# Altium project STM32CORE.PrjPcb
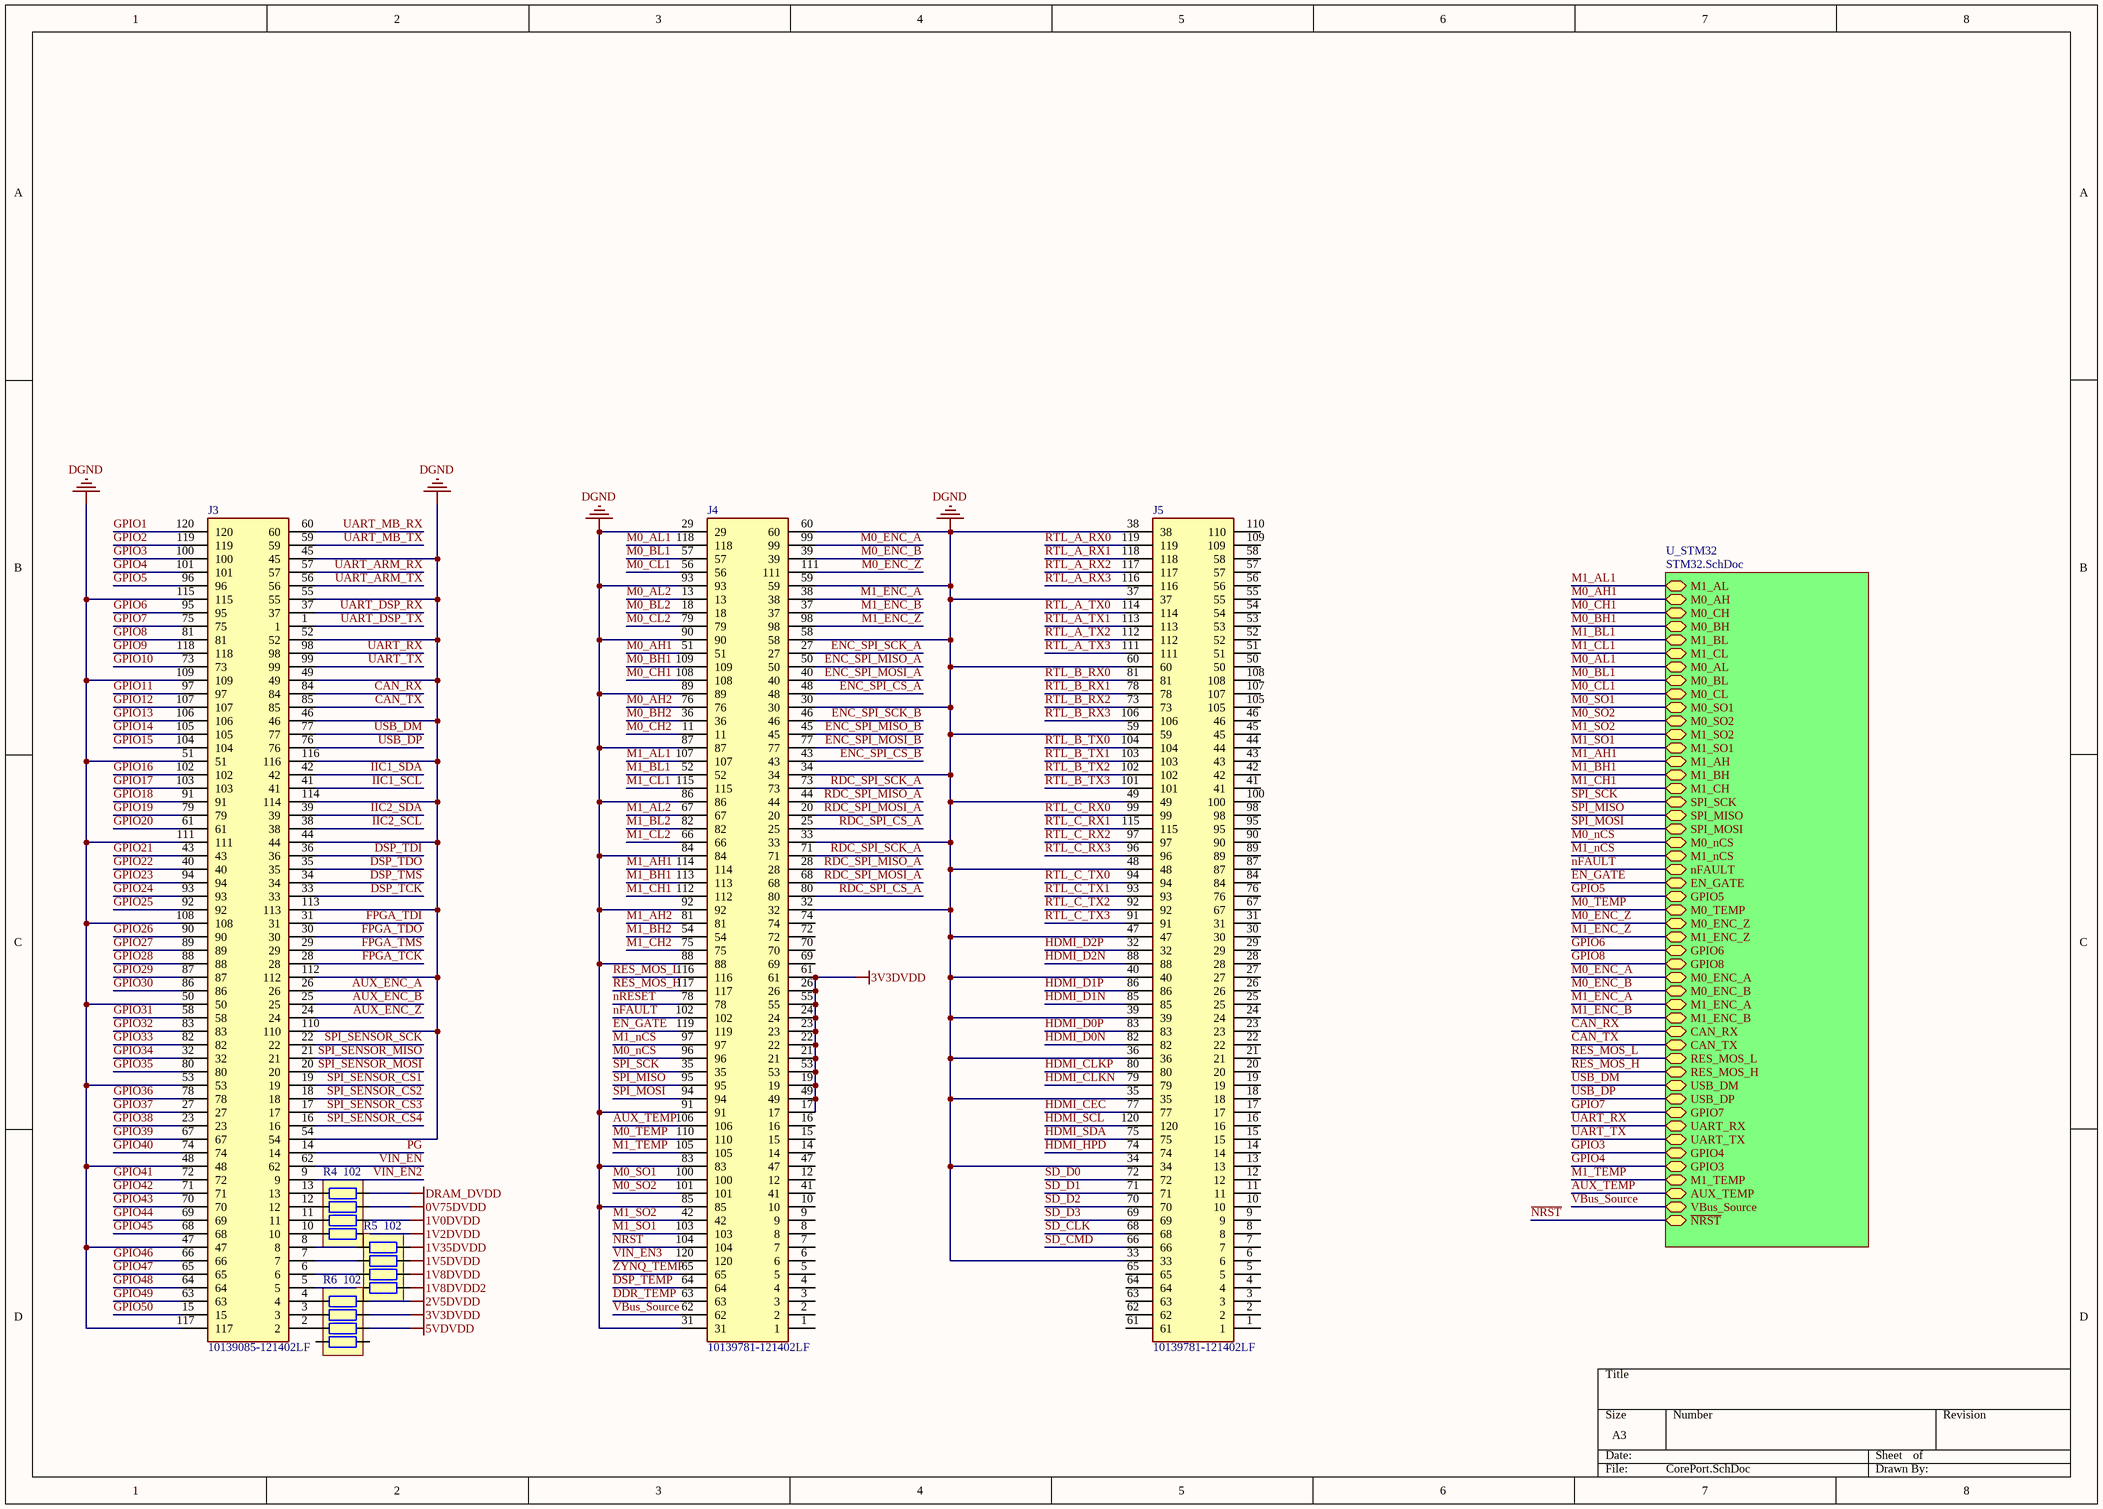
[diagram p0: CorePort.SchDoc]
2 sheets, 42 parts. Net scope: hierarchical (ports join the sheet entries above them; power ports are global).
Board file: STM_Core_BRD.PcbDoc
Sheets:
  CorePort.SchDoc
    U_STM32 = STM32.SchDoc

## Sheet CorePort.SchDoc
size A3; SheetNumber: 1; SheetTotal: 2

### Parts
J3  10139085-121402LF  [10139085121402LF]
J4  10139781-121402LF  [10139781121402LF]
J5  10139781-121402LF  [10139781121402LF]
R4  102  [RCA-8P4R-0603]
R5  102  [RCA-8P4R-0603]
R6  102  [RCA-8P4R-0603]

### Sub-sheets
U_STM32 = STM32.SchDoc: M1_AL (bidir), M0_AH (bidir), M0_CH (bidir), M0_BH (bidir), M1_BL (bidir), M1_CL (bidir), M0_AL (bidir), M0_BL (bidir), M0_CL (bidir), M0_SO1 (bidir), M0_SO2 (bidir), M1_SO2 (bidir), M1_SO1 (bidir), M1_AH (bidir), M1_BH (bidir), M1_CH (bidir), SPI_SCK (bidir), SPI_MISO (bidir), SPI_MOSI (bidir), M0_nCS (bidir), M1_nCS (bidir), nFAULT (bidir), EN_GATE (bidir), GPIO5 (bidir), M0_TEMP (bidir), M0_ENC_Z (bidir), M1_ENC_Z (bidir), GPIO6 (bidir), GPIO8 (bidir), M0_ENC_A (bidir), M0_ENC_B (bidir), M1_ENC_A (bidir), M1_ENC_B (bidir), CAN_RX (bidir), CAN_TX (bidir), RES_MOS_L (bidir), RES_MOS_H (bidir), USB_DM (bidir), USB_DP (bidir), GPIO7 (bidir), UART_RX (bidir), UART_TX (bidir), GPIO4 (bidir), GPIO3 (bidir), M1_TEMP (bidir), AUX_TEMP (bidir), VBus_Source (bidir), ~{NRST} (bidir)

### Nets
0V75DVDD: R4.7
1V0DVDD: R4.6
1V2DVDD: R4.5
1V5DVDD: R5.7
1V8DVDD: R5.6
1V8DVDD2: R5.5
1V35DVDD: R5.8
2V5DVDD: R6.8
3V3DVDD: J4.17 J4.19 J4.21 J4.22 J4.23 J4.24 J4.26 J4.49 J4.53 J4.55 J4.61 R6.7
5VDVDD: R6.6
DGND: J3.44 J3.45 J3.46 J3.47 J3.48 J3.49 J3.50 J3.51 J3.52 J3.53 J3.54 J3.55 J3.108 J3.109 J3.110 J3.111 J3.112 J3.113 J3.114 J3.115 J3.116 J3.117 J4.29 J4.30 J4.31 J4.32 J4.33 J4.34 J4.58 J4.59 J4.60 J4.83 J4.84 J4.85 J4.86 J4.87 J4.88 J4.89 J4.90 J4.91 J4.92 J4.93 J5.33 J5.34 J5.35 J5.36 J5.37 J5.38 J5.39 J5.40 J5.47 J5.48 J5.49 J5.59 J5.60
DRAM_DVDD: R4.8
AUX_ENC_A: J3.26
AUX_ENC_B: J3.25
AUX_ENC_Z: J3.24
AUX_TEMP: J4.106 ; sheet U_STM32/AUX_TEMP
CAN_RX: J3.84 ; sheet U_STM32/CAN_RX
CAN_TX: J3.85 ; sheet U_STM32/CAN_TX
DDR_TEMP: J4.63
DSP_TCK: J3.33
DSP_TDI: J3.36
DSP_TDO: J3.35
DSP_TEMP: J4.64
DSP_TMS: J3.34
EN_GATE: J4.119 ; sheet U_STM32/EN_GATE
ENC_SPI_CS_A: J4.48
ENC_SPI_CS_B: J4.43
ENC_SPI_MISO_A: J4.50
ENC_SPI_MISO_B: J4.45
ENC_SPI_MOSI_A: J4.40
ENC_SPI_MOSI_B: J4.77
ENC_SPI_SCK_A: J4.27
ENC_SPI_SCK_B: J4.46
FPGA_TCK: J3.28
FPGA_TDI: J3.31
FPGA_TDO: J3.30
FPGA_TMS: J3.29
GPIO1: J3.120
GPIO2: J3.119
GPIO3: J3.100 ; sheet U_STM32/GPIO4
GPIO4: J3.101 ; sheet U_STM32/GPIO3
GPIO5: J3.96 ; sheet U_STM32/GPIO5
GPIO6: J3.95 ; sheet U_STM32/GPIO6
GPIO7: J3.75 ; sheet U_STM32/GPIO7
GPIO8: J3.81 ; sheet U_STM32/GPIO8
GPIO9: J3.118
GPIO10: J3.73
GPIO11: J3.97
GPIO12: J3.107
GPIO13: J3.106
GPIO14: J3.105
GPIO15: J3.104
GPIO16: J3.102
GPIO17: J3.103
GPIO18: J3.91
GPIO19: J3.79
GPIO20: J3.61
GPIO21: J3.43
GPIO22: J3.40
GPIO23: J3.94
GPIO24: J3.93
GPIO25: J3.92
GPIO26: J3.90
GPIO27: J3.89
GPIO28: J3.88
GPIO29: J3.87
GPIO30: J3.86
GPIO31: J3.58
GPIO32: J3.83
GPIO33: J3.82
GPIO34: J3.32
GPIO35: J3.80
GPIO36: J3.78
GPIO37: J3.27
GPIO38: J3.23
GPIO39: J3.67
GPIO40: J3.74
GPIO41: J3.72
GPIO42: J3.71
GPIO43: J3.70
GPIO44: J3.69
GPIO45: J3.68
GPIO46: J3.66
GPIO47: J3.65
GPIO48: J3.64
GPIO49: J3.63
GPIO50: J3.15
HDMI_CEC: J5.77
HDMI_CLKN: J5.79
HDMI_CLKP: J5.80
HDMI_D0N: J5.82
HDMI_D0P: J5.83
HDMI_D1N: J5.85
HDMI_D1P: J5.86
HDMI_D2N: J5.88
HDMI_D2P: J5.32
HDMI_HPD: J5.74
HDMI_SCL: J5.120
HDMI_SDA: J5.75
IIC1_SCL: J3.41
IIC1_SDA: J3.42
IIC2_SCL: J3.38
IIC2_SDA: J3.39
M0_AH1: J4.51 ; sheet U_STM32/M0_AH
M0_AH2: J4.76
M0_AL1: J4.118 ; sheet U_STM32/M0_AL
M0_AL2: J4.13
M0_BH1: J4.109 ; sheet U_STM32/M0_BH
M0_BH2: J4.36
M0_BL1: J4.57 ; sheet U_STM32/M0_BL
M0_BL2: J4.18
M0_CH1: J4.108 ; sheet U_STM32/M0_CH
M0_CH2: J4.11
M0_CL1: J4.56 ; sheet U_STM32/M0_CL
M0_CL2: J4.79
M0_ENC_A: J4.99 ; sheet U_STM32/M0_ENC_A
M0_ENC_B: J4.39 ; sheet U_STM32/M0_ENC_B
M0_ENC_Z: J4.111 ; sheet U_STM32/M0_ENC_Z
M0_nCS: J4.96 ; sheet U_STM32/M0_nCS
M0_SO1: J4.100 ; sheet U_STM32/M0_SO1
M0_SO2: J4.101 ; sheet U_STM32/M0_SO2
M0_TEMP: J4.110 ; sheet U_STM32/M0_TEMP
M1_AH1: J4.114 ; sheet U_STM32/M1_AH
M1_AH2: J4.81
M1_AL1: J4.107 ; sheet U_STM32/M1_AL
M1_AL2: J4.67
M1_BH1: J4.113 ; sheet U_STM32/M1_BH
M1_BH2: J4.54
M1_BL1: J4.52 ; sheet U_STM32/M1_BL
M1_BL2: J4.82
M1_CH1: J4.112 ; sheet U_STM32/M1_CH
M1_CH2: J4.75
M1_CL1: J4.115 ; sheet U_STM32/M1_CL
M1_CL2: J4.66
M1_ENC_A: J4.38 ; sheet U_STM32/M1_ENC_A
M1_ENC_B: J4.37 ; sheet U_STM32/M1_ENC_B
M1_ENC_Z: J4.98 ; sheet U_STM32/M1_ENC_Z
M1_nCS: J4.97 ; sheet U_STM32/M1_nCS
M1_SO1: J4.103 ; sheet U_STM32/M1_SO1
M1_SO2: J4.42 ; sheet U_STM32/M1_SO2
M1_TEMP: J4.105 ; sheet U_STM32/M1_TEMP
~{NRST}: J4.104 ; sheet U_STM32/~{NRST}
nFAULT: J4.102 ; sheet U_STM32/nFAULT
nRESET: J4.78
PG: J3.14
RDC_SPI_CS_A: J4.25 J4.80
RDC_SPI_MISO_A: J4.28 J4.44
RDC_SPI_MOSI_A: J4.20 J4.68
RDC_SPI_SCK_A: J4.71 J4.73
RES_MOS_H: J4.117 ; sheet U_STM32/RES_MOS_H
RES_MOS_L: J4.116 ; sheet U_STM32/RES_MOS_L
RTL_A_RX0: J5.119
RTL_A_RX1: J5.118
RTL_A_RX2: J5.117
RTL_A_RX3: J5.116
RTL_A_TX0: J5.114
RTL_A_TX1: J5.113
RTL_A_TX2: J5.112
RTL_A_TX3: J5.111
RTL_B_RX0: J5.81
RTL_B_RX1: J5.78
RTL_B_RX2: J5.73
RTL_B_RX3: J5.106
RTL_B_TX0: J5.104
RTL_B_TX1: J5.103
RTL_B_TX2: J5.102
RTL_B_TX3: J5.101
RTL_C_RX0: J5.99
RTL_C_RX1: J5.115
RTL_C_RX2: J5.97
RTL_C_RX3: J5.96
RTL_C_TX0: J5.94
RTL_C_TX1: J5.93
RTL_C_TX2: J5.92
RTL_C_TX3: J5.91
SD_CLK: J5.68
SD_CMD: J5.66
SD_D0: J5.72
SD_D1: J5.71
SD_D2: J5.70
SD_D3: J5.69
SPI_MISO: J4.95 ; sheet U_STM32/SPI_MISO
SPI_MOSI: J4.94 ; sheet U_STM32/SPI_MOSI
SPI_SCK: J4.35 ; sheet U_STM32/SPI_SCK
SPI_SENSOR_CS1: J3.19
SPI_SENSOR_CS2: J3.18
SPI_SENSOR_CS3: J3.17
SPI_SENSOR_CS4: J3.16
SPI_SENSOR_MISO: J3.21
SPI_SENSOR_MOSI: J3.20
SPI_SENSOR_SCK: J3.22
UART_ARM_RX: J3.57
UART_ARM_TX: J3.56
UART_DSP_RX: J3.37
UART_DSP_TX: J3.1
UART_MB_RX: J3.60
UART_MB_TX: J3.59
UART_RX: J3.98 ; sheet U_STM32/UART_RX
UART_TX: J3.99 ; sheet U_STM32/UART_TX
USB_DM: J3.77 ; sheet U_STM32/USB_DM
USB_DP: J3.76 ; sheet U_STM32/USB_DP
VBus_Source: J4.62 ; sheet U_STM32/VBus_Source
VIN_EN: J3.62
VIN_EN2: J3.9
VIN_EN3: J4.120
ZYNQ_TEMP: J4.65
NetJ3_2: J3.2 R6.3
NetJ3_3: J3.3 R6.2
NetJ3_4: J3.4 R6.1
NetJ3_5: J3.5 R5.4
NetJ3_6: J3.6 R5.3
NetJ3_7: J3.7 R5.2
NetJ3_8: J3.8 R5.1
NetJ3_10: J3.10 R4.4
NetJ3_11: J3.11 R4.3
NetJ3_12: J3.12 R4.2
NetJ3_13: J3.13 R4.1

Not connected (* = marked no-connect by the designer): J4 1 2 3 4 5 6 7 8 9 10 12 14 15 16 41 47 69 70 72 74; J5 1 2 3 4 5 6 7 8 9 10 11 12 13 14 15 16 17 18 19 20 21 22 23 24 25 26 27 28 29 30 31 41 42 43 44 45 46 50 51 52 53 54 55 56 57 58 61 62 63 64 65 67 76 84 87 89 90 95 98 100 105 107 108 109 110; R6 4 5

### Library data of the parts
J3 = 10139085-121402LF: Connector FE; Manufacturer_Name: Amphenol Communications Solutions; Manufacturer_Part_Number: 10139781-121402LF; Datasheet Link: https://cdn.amphenol-cs.com/media/wysiwyg/files/drawing/10139781.pdf; Height: 4.3mm
J4 J5 = 10139781-121402LF: Connector M; Manufacturer_Name: Amphenol Communications Solutions; Datasheet Link: https://cdn.amphenol-cs.com/media/wysiwyg/files/drawing/10139781.pdf; Height: 4.3mm; Manufacturer_Part_Number: 10139781-121402LF
R4-R6 = R-8P4R: 贴片排阻; BOM名称: 贴片网络排阻; 版权归属: 封装库来自淘宝 ID：黄晶宝石; 联系售后: https://shop463601444.taobao.com

## Sheet STM32.SchDoc
size A3; SheetNumber: 2; SheetTotal: 2
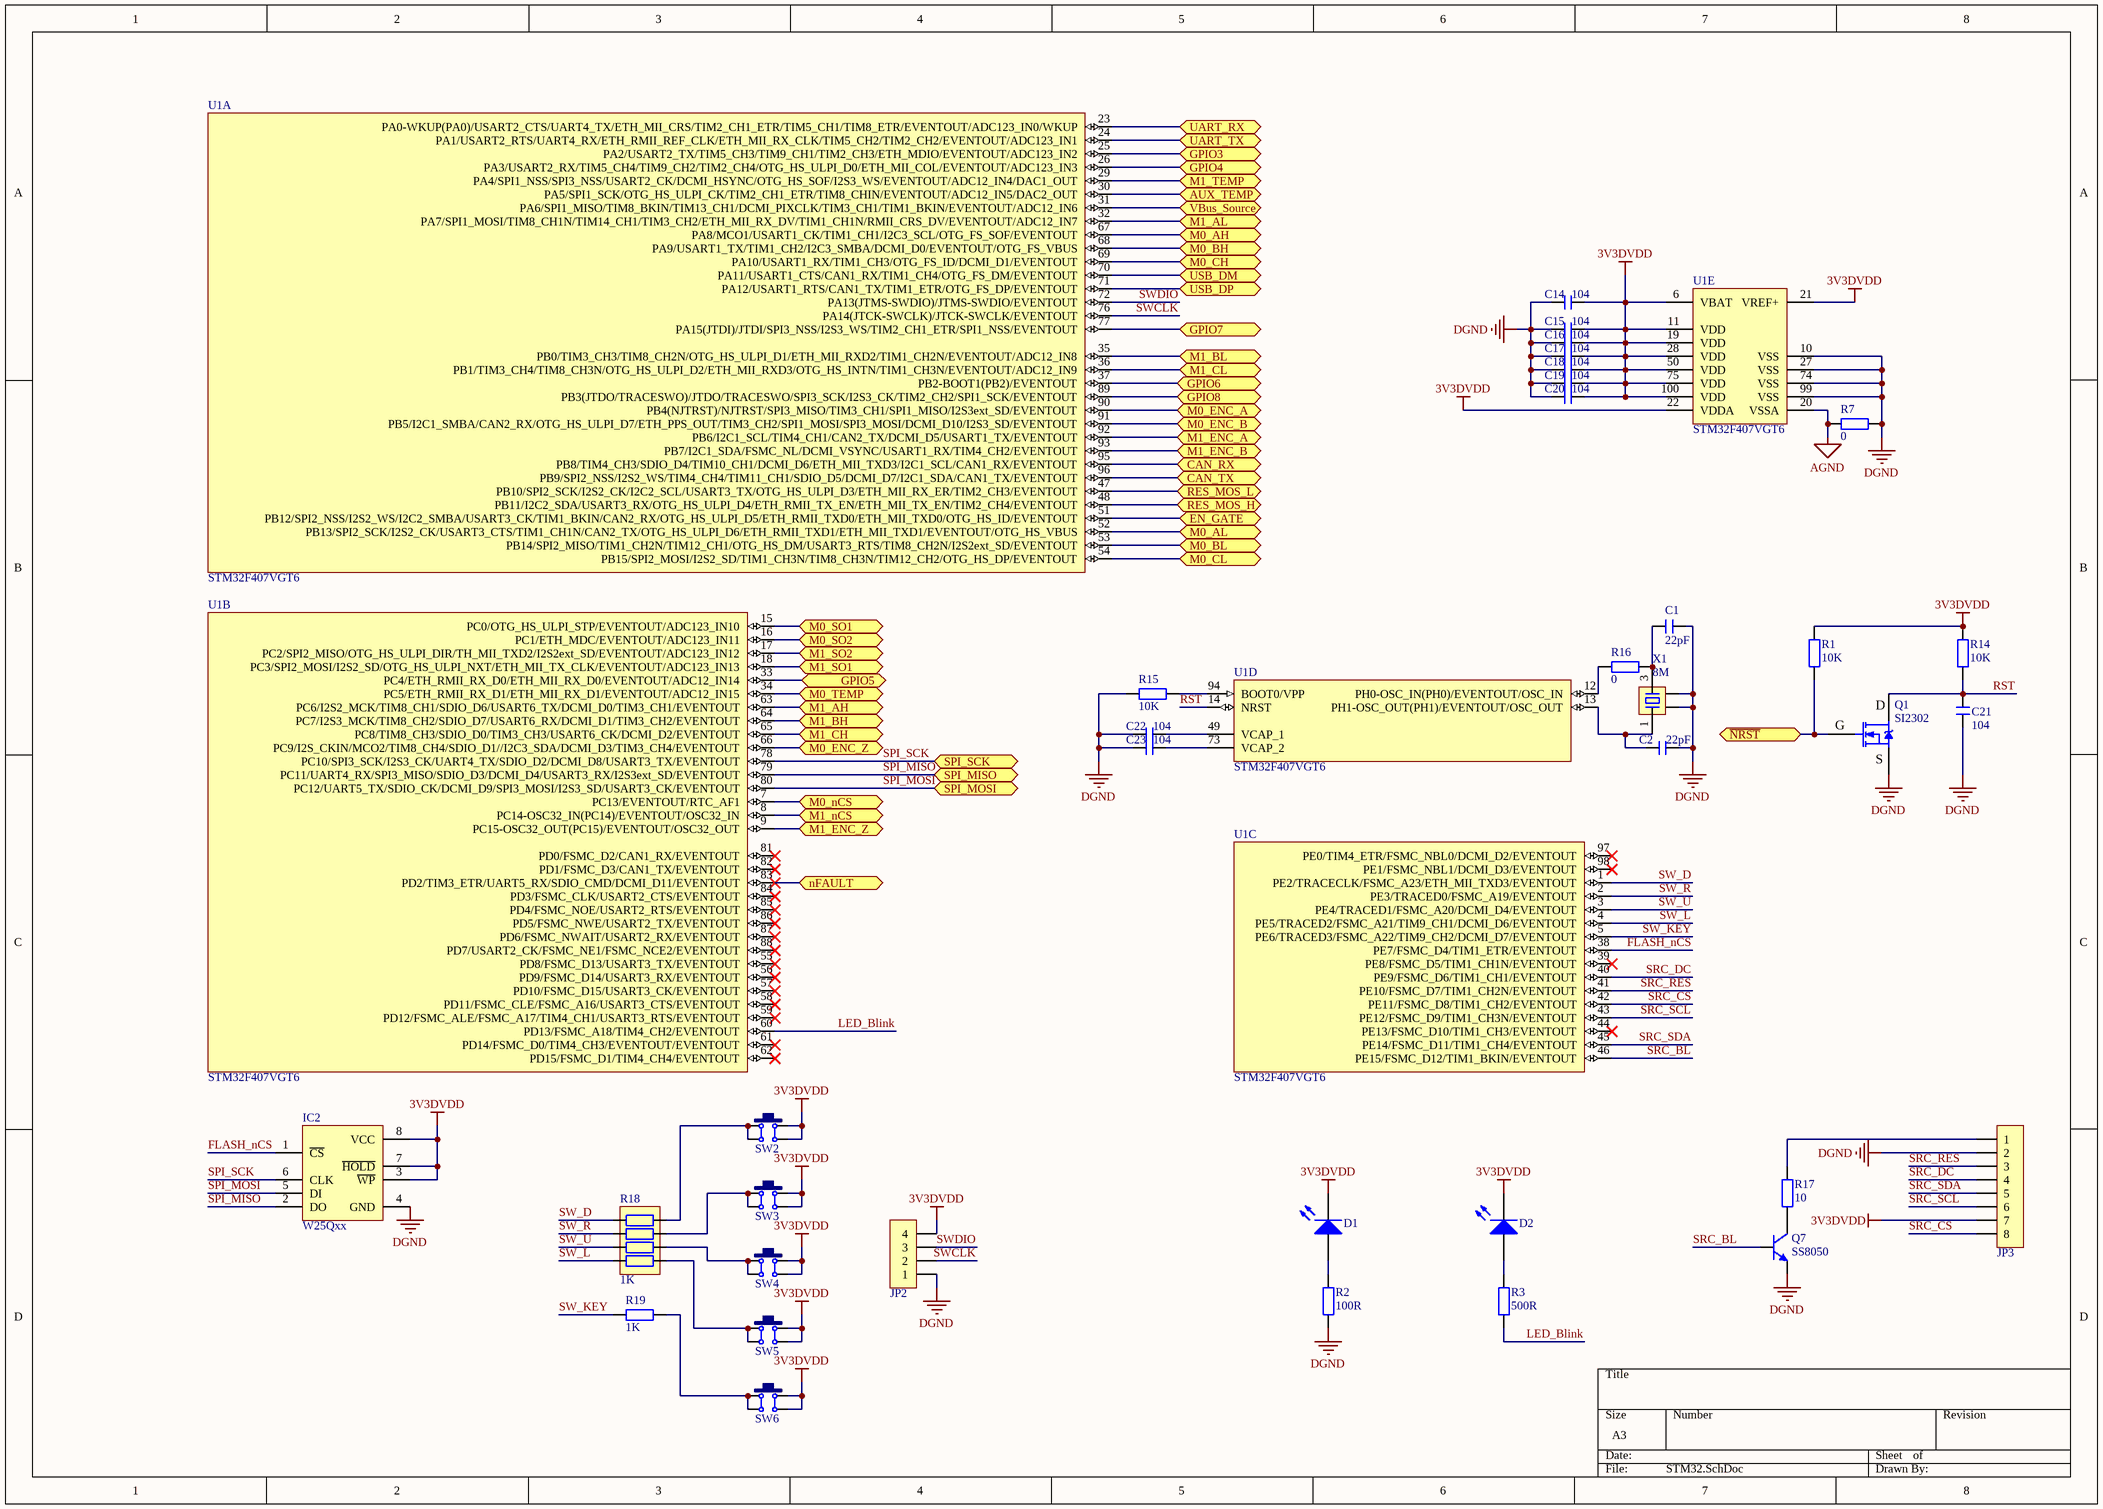
[diagram p1: STM32.SchDoc]

### Parts
C1  22pF  [C 0603_L]
C2  22pF  [C 0603_L]
C14  104  [C 0603_L]
C15  104  [C 0603_L]
C16  104  [C 0603_L]
C17  104  [C 0603_L]
C18  104  [C 0603_L]
C19  104  [C 0603_L]
C20  104  [C 0603_L]
C21  104  [C 0603_L]
C22  104  [C 0603_L]
C23  104  [C 0603_L]
D1  LED  [LED 0603W]  (value not drawn)
D2  LED  [LED 0603W]  (value not drawn)
IC2  W25Qxx  [SOP8W_N]
JP2  HDR-1X4  [HDR2.54-LI-4P]  (value not drawn)
JP3  HDR-1X8  [FPC0.5 2H-WS-8P]  (value not drawn)
Q1  SI2302  [SOT23-3N]
Q7  SS8050  [SOT23-3N]
R1  10K  [R 0603_L]
R2  100R  [R 0603_L]
R3  500R  [R 0603_L]
R7  0  [R 0603_L]
R14  10K  [R 0603_L]
R15  10K  [R 0603_L]
R16  0  [R 0603_L]
R17  10  [R 0603_L]
R18  1K  [RCA-8P4R-0603]
R19  1K  [R 0603_L]
SW2  6x6x5  [TSW SMD-6*6*4.3]  (value not drawn)
SW3  6x6x5  [TSW SMD-6*6*4.3]  (value not drawn)
SW4  6x6x5  [TSW SMD-6*6*4.3]  (value not drawn)
SW5  6x6x5  [TSW SMD-6*6*4.3]  (value not drawn)
SW6  6x6x5  [TSW SMD-6*6*4.3]  (value not drawn)
U1  STM32F407VGT6  [LQFP100_V]  (parts A,B,C,D,E of 5)
X1  8M  [OSC 3225-4P]

### Ports
AUX_TEMP (bidir), CAN_RX (bidir), CAN_TX (bidir), EN_GATE (bidir), GPIO3 (bidir), GPIO4 (bidir), GPIO5 (bidir), GPIO6 (bidir), GPIO7 (bidir), GPIO8 (bidir), M0_AH (bidir), M0_AL (bidir), M0_BH (bidir), M0_BL (bidir), M0_CH (bidir), M0_CL (bidir), M0_ENC_A (bidir), M0_ENC_B (bidir), M0_ENC_Z (bidir), M0_nCS (bidir), M0_SO1 (bidir), M0_SO2 (bidir), M0_TEMP (bidir), M1_AH (bidir), M1_AL (bidir), M1_BH (bidir), M1_BL (bidir), M1_CH (bidir), M1_CL (bidir), M1_ENC_A (bidir), M1_ENC_B (bidir), M1_ENC_Z (bidir), M1_nCS (bidir), M1_SO1 (bidir), M1_SO2 (bidir), M1_TEMP (bidir), nFAULT (bidir), RES_MOS_H (bidir), RES_MOS_L (bidir), SPI_MISO (bidir), SPI_MOSI (bidir), SPI_SCK (bidir), UART_RX (bidir), UART_TX (bidir), USB_DM (bidir), USB_DP (bidir), VBus_Source (bidir), ~{NRST} (bidir)

### Nets
3V3DVDD: C14.2 C15.2 C16.2 C17.2 C18.2 C19.2 C20.2 D1.2(K) D2.2(K) IC2.3(~{WP}) IC2.7(~{HOLD}) IC2.8(VCC) JP2.4 JP3.7 R1.2 R14.2 SW2.2 SW2.3 SW3.2 SW3.3 SW4.2 SW4.3 SW5.2 SW5.3 SW6.2 SW6.3 U1.6(VBAT) U1.11(VDD) U1.19(VDD) U1.21(VREF+) U1.22(VDDA) U1.28(VDD) U1.50(VDD) U1.75(VDD) U1.100(VDD)
AGND: R7.2 U1.20(VSSA)
DGND: C1.1 C2.2 C14.1 C15.1 C16.1 C17.1 C18.1 C19.1 C20.1 C21.1 C22.1 C23.1 IC2.4(GND) JP2.1 JP3.2 Q1.2(S) Q7.2(E) R2.1 R7.1 R15.1 U1.10(VSS) U1.27(VSS) U1.74(VSS) U1.99(VSS) X1.2 X1.4
AUX_TEMP: U1.30(PA5/SPI1_SCK/OTG_HS_ULPI_CK/TIM2_CH1_ETR/TIM8_CHIN/EVENTOUT/ADC12_IN5/DAC2_OUT) ; port AUX_TEMP
CAN_RX: U1.95(PB8/TIM4_CH3/SDIO_D4/TIM10_CH1/DCMI_D6/ETH_MII_TXD3/I2C1_SCL/CAN1_RX/EVENTOUT) ; port CAN_RX
CAN_TX: U1.96(PB9/SPI2_NSS/I2S2_WS/TIM4_CH4/TIM11_CH1/SDIO_D5/DCMI_D7/I2C1_SDA/CAN1_TX/EVENTOUT) ; port CAN_TX
EN_GATE: U1.51(PB12/SPI2_NSS/I2S2_WS/I2C2_SMBA/USART3_CK/TIM1_BKIN/CAN2_RX/OTG_HS_ULPI_D5/ETH_RMII_TXD0/ETH_MII_TXD0/OTG_HS_ID/EVENTOUT) ; port EN_GATE
FLASH_nCS: IC2.1(~{CS}) U1.38(PE7/FSMC_D4/TIM1_ETR/EVENTOUT)
GPIO3: U1.26(PA3/USART2_RX/TIM5_CH4/TIM9_CH2/TIM2_CH4/OTG_HS_ULPI_D0/ETH_MII_COL/EVENTOUT/ADC123_IN3) ; port GPIO4
GPIO4: U1.25(PA2/USART2_TX/TIM5_CH3/TIM9_CH1/TIM2_CH3/ETH_MDIO/EVENTOUT/ADC123_IN2) ; port GPIO3
GPIO5: U1.33(PC4/ETH_RMII_RX_D0/ETH_MII_RX_D0/EVENTOUT/ADC12_IN14) ; port GPIO5
GPIO6: U1.37(PB2-BOOT1(PB2)/EVENTOUT) ; port GPIO6
GPIO7: U1.77(PA15(JTDI)/JTDI/SPI3_NSS/I2S3_WS/TIM2_CH1_ETR/SPI1_NSS/EVENTOUT) ; port GPIO7
GPIO8: U1.89(PB3(JTDO/TRACESWO)/JTDO/TRACESWO/SPI3_SCK/I2S3_CK/TIM2_CH2/SPI1_SCK/EVENTOUT) ; port GPIO8
LED_Blink: R3.1 U1.60(PD13/FSMC_A18/TIM4_CH2/EVENTOUT)
M0_AH1: U1.67(PA8/MCO1/USART1_CK/TIM1_CH1/I2C3_SCL/OTG_FS_SOF/EVENTOUT) ; port M0_AH
M0_AL1: U1.52(PB13/SPI2_SCK/I2S2_CK/USART3_CTS/TIM1_CH1N/CAN2_TX/OTG_HS_ULPI_D6/ETH_RMII_TXD1/ETH_MII_TXD1/EVENTOUT/OTG_HS_VBUS) ; port M0_AL
M0_BH1: U1.68(PA9/USART1_TX/TIM1_CH2/I2C3_SMBA/DCMI_D0/EVENTOUT/OTG_FS_VBUS) ; port M0_BH
M0_BL1: U1.53(PB14/SPI2_MISO/TIM1_CH2N/TIM12_CH1/OTG_HS_DM/USART3_RTS/TIM8_CH2N/I2S2ext_SD/EVENTOUT) ; port M0_BL
M0_CH1: U1.69(PA10/USART1_RX/TIM1_CH3/OTG_FS_ID/DCMI_D1/EVENTOUT) ; port M0_CH
M0_CL1: U1.54(PB15/SPI2_MOSI/I2S2_SD/TIM1_CH3N/TIM8_CH3N/TIM12_CH2/OTG_HS_DP/EVENTOUT) ; port M0_CL
M0_ENC_A: U1.90(PB4(NJTRST)/NJTRST/SPI3_MISO/TIM3_CH1/SPI1_MISO/I2S3ext_SD/EVENTOUT) ; port M0_ENC_A
M0_ENC_B: U1.91(PB5/I2C1_SMBA/CAN2_RX/OTG_HS_ULPI_D7/ETH_PPS_OUT/TIM3_CH2/SPI1_MOSI/SPI3_MOSI/DCMI_D10/I2S3_SD/EVENTOUT) ; port M0_ENC_B
M0_ENC_Z: U1.66(PC9/I2S_CKIN/MCO2/TIM8_CH4/SDIO_D1//I2C3_SDA/DCMI_D3/TIM3_CH4/EVENTOUT) ; port M0_ENC_Z
M0_nCS: U1.7(PC13/EVENTOUT/RTC_AF1) ; port M0_nCS
M0_SO1: U1.15(PC0/OTG_HS_ULPI_STP/EVENTOUT/ADC123_IN10) ; port M0_SO1
M0_SO2: U1.16(PC1/ETH_MDC/EVENTOUT/ADC123_IN11) ; port M0_SO2
M0_TEMP: U1.34(PC5/ETH_RMII_RX_D1/ETH_MII_RX_D1/EVENTOUT/ADC12_IN15) ; port M0_TEMP
M1_AH1: U1.63(PC6/I2S2_MCK/TIM8_CH1/SDIO_D6/USART6_TX/DCMI_D0/TIM3_CH1/EVENTOUT) ; port M1_AH
M1_AL1: U1.32(PA7/SPI1_MOSI/TIM8_CH1N/TIM14_CH1/TIM3_CH2/ETH_MII_RX_DV/TIM1_CH1N/RMII_CRS_DV/EVENTOUT/ADC12_IN7) ; port M1_AL
M1_BH1: U1.64(PC7/I2S3_MCK/TIM8_CH2/SDIO_D7/USART6_RX/DCMI_D1/TIM3_CH2/EVENTOUT) ; port M1_BH
M1_BL1: U1.35(PB0/TIM3_CH3/TIM8_CH2N/OTG_HS_ULPI_D1/ETH_MII_RXD2/TIM1_CH2N/EVENTOUT/ADC12_IN8) ; port M1_BL
M1_CH1: U1.65(PC8/TIM8_CH3/SDIO_D0/TIM3_CH3/USART6_CK/DCMI_D2/EVENTOUT) ; port M1_CH
M1_CL1: U1.36(PB1/TIM3_CH4/TIM8_CH3N/OTG_HS_ULPI_D2/ETH_MII_RXD3/OTG_HS_INTN/TIM1_CH3N/EVENTOUT/ADC12_IN9) ; port M1_CL
M1_ENC_A: U1.92(PB6/I2C1_SCL/TIM4_CH1/CAN2_TX/DCMI_D5/USART1_TX/EVENTOUT) ; port M1_ENC_A
M1_ENC_B: U1.93(PB7/I2C1_SDA/FSMC_NL/DCMI_VSYNC/USART1_RX/TIM4_CH2/EVENTOUT) ; port M1_ENC_B
M1_ENC_Z: U1.9(PC15-OSC32_OUT(PC15)/EVENTOUT/OSC32_OUT) ; port M1_ENC_Z
M1_nCS: U1.8(PC14-OSC32_IN(PC14)/EVENTOUT/OSC32_IN) ; port M1_nCS
M1_SO1: U1.18(PC3/SPI2_MOSI/I2S2_SD/OTG_HS_ULPI_NXT/ETH_MII_TX_CLK/EVENTOUT/ADC123_IN13) ; port M1_SO1
M1_SO2: U1.17(PC2/SPI2_MISO/OTG_HS_ULPI_DIR/TH_MII_TXD2/I2S2ext_SD/EVENTOUT/ADC123_IN12) ; port M1_SO2
M1_TEMP: U1.29(PA4/SPI1_NSS/SPI3_NSS/USART2_CK/DCMI_HSYNC/OTG_HS_SOF/I2S3_WS/EVENTOUT/ADC12_IN4/DAC1_OUT) ; port M1_TEMP
~{NRST}: Q1.1(G) R1.1 ; port ~{NRST}
nFAULT: U1.83(PD2/TIM3_ETR/UART5_RX/SDIO_CMD/DCMI_D11/EVENTOUT) ; port nFAULT
RES_MOS_H: U1.48(PB11/I2C2_SDA/USART3_RX/OTG_HS_ULPI_D4/ETH_RMII_TX_EN/ETH_MII_TX_EN/TIM2_CH4/EVENTOUT) ; port RES_MOS_H
RES_MOS_L: U1.47(PB10/SPI2_SCK/I2S2_CK/I2C2_SCL/USART3_TX/OTG_HS_ULPI_D3/ETH_MII_RX_ER/TIM2_CH3/EVENTOUT) ; port RES_MOS_L
RST: C21.2 Q1.3(D) R14.1 U1.14(NRST)
SPI_MISO: IC2.2(DO) U1.79(PC11/UART4_RX/SPI3_MISO/SDIO_D3/DCMI_D4/USART3_RX/I2S3ext_SD/EVENTOUT) ; port SPI_MISO
SPI_MOSI: IC2.5(DI) U1.80(PC12/UART5_TX/SDIO_CK/DCMI_D9/SPI3_MOSI/I2S3_SD/USART3_CK/EVENTOUT) ; port SPI_MOSI
SPI_SCK: IC2.6(CLK) U1.78(PC10/SPI3_SCK/I2S3_CK/UART4_TX/SDIO_D2/DCMI_D8/USART3_TX/EVENTOUT) ; port SPI_SCK
SRC_BL: Q7.1(B) U1.46(PE15/FSMC_D12/TIM1_BKIN/EVENTOUT)
SRC_CS: JP3.8 U1.42(PE11/FSMC_D8/TIM1_CH2/EVENTOUT)
SRC_DC: JP3.4 U1.40(PE9/FSMC_D6/TIM1_CH1/EVENTOUT)
SRC_RES: JP3.3 U1.41(PE10/FSMC_D7/TIM1_CH2N/EVENTOUT)
SRC_SCL: JP3.6 U1.43(PE12/FSMC_D9/TIM1_CH3N/EVENTOUT)
SRC_SDA: JP3.5 U1.45(PE14/FSMC_D11/TIM1_CH4/EVENTOUT)
SW_D: R18.8 U1.1(PE2/TRACECLK/FSMC_A23/ETH_MII_TXD3/EVENTOUT)
SW_KEY: R19.2 U1.5(PE6/TRACED3/FSMC_A22/TIM9_CH2/DCMI_D7/EVENTOUT)
SW_L: R18.5 U1.4(PE5/TRACED2/FSMC_A21/TIM9_CH1/DCMI_D6/EVENTOUT)
SW_R: R18.7 U1.2(PE3/TRACED0/FSMC_A19/EVENTOUT)
SW_U: R18.6 U1.3(PE4/TRACED1/FSMC_A20/DCMI_D4/EVENTOUT)
SWCLK: JP2.2 U1.76(PA14(JTCK-SWCLK)/JTCK-SWCLK/EVENTOUT)
SWDIO: JP2.3 U1.72(PA13(JTMS-SWDIO)/JTMS-SWDIO/EVENTOUT)
UART_RX: U1.23(PA0-WKUP(PA0)/USART2_CTS/UART4_TX/ETH_MII_CRS/TIM2_CH1_ETR/TIM5_CH1/TIM8_ETR/EVENTOUT/ADC123_IN0/WKUP) ; port UART_RX
UART_TX: U1.24(PA1/USART2_RTS/UART4_RX/ETH_RMII_REF_CLK/ETH_MII_RX_CLK/TIM5_CH2/TIM2_CH2/EVENTOUT/ADC123_IN1) ; port UART_TX
USB_DM: U1.70(PA11/USART1_CTS/CAN1_RX/TIM1_CH4/OTG_FS_DM/EVENTOUT) ; port USB_DM
USB_DP: U1.71(PA12/USART1_RTS/CAN1_TX/TIM1_ETR/OTG_FS_DP/EVENTOUT) ; port USB_DP
VBus_Source: U1.31(PA6/SPI1_MISO/TIM8_BKIN/TIM13_CH1/DCMI_PIXCLK/TIM3_CH1/TIM1_BKIN/EVENTOUT/ADC12_IN6) ; port VBus_Source
NetC1_2: C1.2 R16.1 X1.3
NetC2_1: C2.1 U1.13(PH1-OSC_OUT(PH1)/EVENTOUT/OSC_OUT) X1.1
NetC22_2: C22.2 U1.49(VCAP_1)
NetC23_2: C23.2 U1.73(VCAP_2)
NetD1_1: D1.1(A) R2.2
NetD2_1: D2.1(A) R3.2
NetJP3_1: JP3.1 R17.2
NetQ7_3: Q7.3(C) R17.1
NetR15_2: R15.2 U1.94(BOOT0/VPP)
NetR16_2: R16.2 U1.12(PH0-OSC_IN(PH0)/EVENTOUT/OSC_IN)
NetR18_1: R18.1 SW2.1 SW2.4
NetR18_2: R18.2 SW3.1 SW3.4
NetR18_3: R18.3 SW4.1 SW4.4
NetR18_4: R18.4 SW5.1 SW5.4
NetR19_1: R19.1 SW6.1 SW6.4

Not connected (* = marked no-connect by the designer): U1 39(PE8/FSMC_D5/TIM1_CH1N/EVENTOUT)* 44(PE13/FSMC_D10/TIM1_CH3/EVENTOUT)* 55(PD8/FSMC_D13/USART3_TX/EVENTOUT)* 56(PD9/FSMC_D14/USART3_RX/EVENTOUT)* 57(PD10/FSMC_D15/USART3_CK/EVENTOUT)* 58(PD11/FSMC_CLE/FSMC_A16/USART3_CTS/EVENTOUT)* 59(PD12/FSMC_ALE/FSMC_A17/TIM4_CH1/USART3_RTS/EVENTOUT)* 61(PD14/FSMC_D0/TIM4_CH3/EVENTOUT/EVENTOUT)* 62(PD15/FSMC_D1/TIM4_CH4/EVENTOUT)* 81(PD0/FSMC_D2/CAN1_RX/EVENTOUT)* 82(PD1/FSMC_D3/CAN1_TX/EVENTOUT)* 84(PD3/FSMC_CLK/USART2_CTS/EVENTOUT)* 85(PD4/FSMC_NOE/USART2_RTS/EVENTOUT)* 86(PD5/FSMC_NWE/USART2_TX/EVENTOUT)* 87(PD6/FSMC_NWAIT/USART2_RX/EVENTOUT)* 88(PD7/USART2_CK/FSMC_NE1/FSMC_NCE2/EVENTOUT)* 97(PE0/TIM4_ETR/FSMC_NBL0/DCMI_D2/EVENTOUT)* 98(PE1/FSMC_NBL1/DCMI_D3/EVENTOUT)*

### Library data of the parts
C1 C2 C14-C23 = C: 贴片电容; BOM名称: 无极性贴片电容; 淘宝ID: 封装库来自淘宝 ID：黄晶宝石; 联系售后，技术支持: https://shop463601444.taobao.com; 唯一出售店铺网址: https://shop463601444.taobao.com
D1 D2 = LED: 发光二极管; 技术支持，联系售后: https://shop463601444.taobao.com
IC2 = W25Q: SPI Flash; BOM名称: 外置Flash; 版权归属: 封装库来自淘宝 ID：黄晶宝石; 学习资源: https://shop463601444.taobao.com
JP2 = Header 4: 4P接插件; 版权归属: 封装库来自淘宝 ID：黄晶宝石; BOM名称: 4P接插件; 学习资源: https://shop463601444.taobao.com
JP3 = Header 8: 8P接插件; 版权归属: 封装库来自淘宝 ID：黄晶宝石; BOM名称: 8P接插件; 学习资源: https://shop463601444.taobao.com
Q1 = SI2302: N沟道场效应管; 技术支持，联系售后: 封装库来自淘宝 ID：黄晶宝石; BOM名称: N沟道场效应管; 学习资源: https://shop463601444.taobao.com
Q7 = 8050-SMD: 高频放大-NPN型; 版权归属: 封装库来自淘宝 ID：黄晶宝石; 属性: 40V 1.5A 1W 100MHZ; BOM名称: 高频放大-NPN型; 联系售后: https://shop463601444.taobao.com
R1-R3 R7 R14-R17 R19 = R: 贴片电阻; 版权归属: 来自淘宝 ID：黄晶宝石; 封装库来自淘宝卖家 ID：黄晶宝石: 其他店铺购入均为盗版，不享受售后技术支持服务，请立即申请退款; BOM名称: 贴片电阻; 联系售后: https://shop463601444.taobao.com
R18 = R-8P4R: as R4 on sheet CorePort; 联系售后: https://shop463601444.taobao.com
SW2-SW6 = TSW SMD-6x6: 贴片6x6轻触开关; 版权归属: 封装库来自淘宝 ID：黄晶宝石; BOM名称: 贴片6x6轻触开关; 唯一出售店铺网址: https://shop463601444.taobao.com
U1 = STM32F407VGT6: ARM Cortex-M4 32b MCU+FPU, 210DMIP, 1024 kB Flash, 192+4 kB RAM, Camera, 82 I/Os, 100-pin LQFP, -40 to +85癈, Tray; Internal RAM: 192kB; Operating Frequency (Processor Speed): 168MHz; A/D Converter: 16x12-bit; D/A Converter: 2x12-bit; 16-bit Timers (IC/OC/PWM): 12x16-bit(24/24/30); 32-bit Timer (IC/OC/PWM): 2x32-bit (8/8/8); Other Timer Functions: 2xWDG, RTC, 24-bit down counter; Serial Interface: 3xSPI/2xI2S/2xI2C/3xUSART(IrDa, ISO7816)/3xUART/2xUSB OTG FS/HS, 2xCAN/Ethernet MAC10/100, SDIO; DatasheetVersion: rev2, Jan-2012; PackageVersion: 2012; PackageReference: LQFP100; PackageDescription: 100-Pin Low Profile Quad Flat Package, 14x14 mm Body, 0.5 mm Pitch; ComponentLink1Description: Manufacturer URL; ComponentLink1URL: http://www.st.com/; ComponentLink2Description: STM32F405/7 Datasheet; ComponentLink2URL: http://www.st.com/internet/com/TECHNICAL_RESOURCES/TECHNICAL_LITERATURE/DATASHEET/DM00037051.pdf; ComponentLink3Description: STM32F4 Web Page; ComponentLink3URL: http://www.st.com/internet/mcu/subclass/1521.jsp
X1 = XTAL-4P: 4脚无源晶振; 版权归属: 封装库来自淘宝卖家 ID：黄晶宝石; BOM名称: 4脚无源晶振; 学习资源: https://shop463601444.taobao.com

## Nets that join several sheets
3V3DVDD: CorePort (12 pins), STM32 (35 pins)
DGND: CorePort (55 pins), STM32 (26 pins)
AUX_TEMP: CorePort (J4.106), STM32 (U1.30)
CAN_RX: CorePort (J3.84), STM32 (U1.95)
CAN_TX: CorePort (J3.85), STM32 (U1.96)
EN_GATE: CorePort (J4.119), STM32 (U1.51)
GPIO3: CorePort (J3.100), STM32 (U1.26)
GPIO4: CorePort (J3.101), STM32 (U1.25)
GPIO5: CorePort (J3.96), STM32 (U1.33)
GPIO6: CorePort (J3.95), STM32 (U1.37)
GPIO7: CorePort (J3.75), STM32 (U1.77)
GPIO8: CorePort (J3.81), STM32 (U1.89)
M0_AH1: CorePort (J4.51), STM32 (U1.67)
M0_AL1: CorePort (J4.118), STM32 (U1.52)
M0_BH1: CorePort (J4.109), STM32 (U1.68)
M0_BL1: CorePort (J4.57), STM32 (U1.53)
M0_CH1: CorePort (J4.108), STM32 (U1.69)
M0_CL1: CorePort (J4.56), STM32 (U1.54)
M0_ENC_A: CorePort (J4.99), STM32 (U1.90)
M0_ENC_B: CorePort (J4.39), STM32 (U1.91)
M0_ENC_Z: CorePort (J4.111), STM32 (U1.66)
M0_nCS: CorePort (J4.96), STM32 (U1.7)
M0_SO1: CorePort (J4.100), STM32 (U1.15)
M0_SO2: CorePort (J4.101), STM32 (U1.16)
M0_TEMP: CorePort (J4.110), STM32 (U1.34)
M1_AH1: CorePort (J4.114), STM32 (U1.63)
M1_AL1: CorePort (J4.107), STM32 (U1.32)
M1_BH1: CorePort (J4.113), STM32 (U1.64)
M1_BL1: CorePort (J4.52), STM32 (U1.35)
M1_CH1: CorePort (J4.112), STM32 (U1.65)
M1_CL1: CorePort (J4.115), STM32 (U1.36)
M1_ENC_A: CorePort (J4.38), STM32 (U1.92)
M1_ENC_B: CorePort (J4.37), STM32 (U1.93)
M1_ENC_Z: CorePort (J4.98), STM32 (U1.9)
M1_nCS: CorePort (J4.97), STM32 (U1.8)
M1_SO1: CorePort (J4.103), STM32 (U1.18)
M1_SO2: CorePort (J4.42), STM32 (U1.17)
M1_TEMP: CorePort (J4.105), STM32 (U1.29)
~{NRST}: CorePort (J4.104), STM32 (Q1.1 R1.1)
nFAULT: CorePort (J4.102), STM32 (U1.83)
RES_MOS_H: CorePort (J4.117), STM32 (U1.48)
RES_MOS_L: CorePort (J4.116), STM32 (U1.47)
SPI_MISO: CorePort (J4.95), STM32 (IC2.2 U1.79)
SPI_MOSI: CorePort (J4.94), STM32 (IC2.5 U1.80)
SPI_SCK: CorePort (J4.35), STM32 (IC2.6 U1.78)
UART_RX: CorePort (J3.98), STM32 (U1.23)
UART_TX: CorePort (J3.99), STM32 (U1.24)
USB_DM: CorePort (J3.77), STM32 (U1.70)
USB_DP: CorePort (J3.76), STM32 (U1.71)
VBus_Source: CorePort (J4.62), STM32 (U1.31)